# EAGLE design detector (EAGLE 7.0.0)
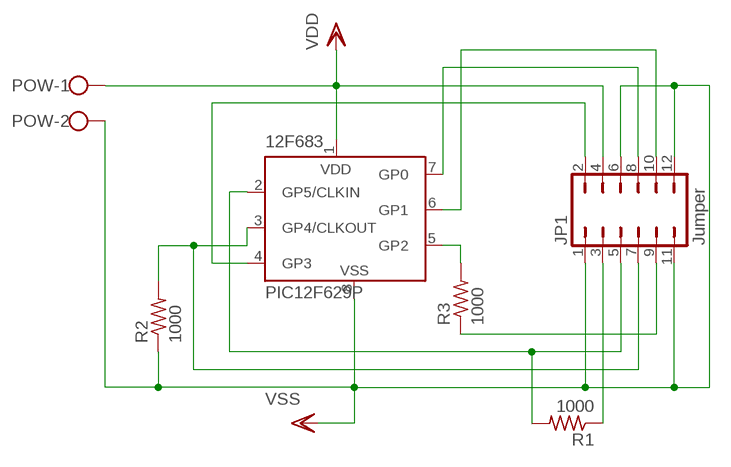
[diagram p0: schematic, sheet 1]

## Parts
12F683  PIC12F629P  [DIL8]
JP1  Jumper  JP6Q  [JP6Q]
POW  W237-102  [W237-102]
R1  1000  R-US_0207/10  [0207/10]
R2  1000  R-US_0207/10  [0207/10]
R3  1000  R-US_0207/10  [0207/10]

## Nets
N$1: 12F683.2(GP5/CLKIN) JP1.5 R1.2
N$3: JP1.9 R3.1
N$4: 12F683.3(GP4/CLKOUT) JP1.7 R2.2
N$5: JP1.3 R1.1
N$6: 12F683.4(GP3) JP1.2
N$7: 12F683.6(GP1) JP1.10
N$8: 12F683.7(GP0) JP1.8
N$9: 12F683.5(GP2) R3.2
VDD: 12F683.1(VDD) JP1.4 POW.1
VSS: 12F683.8(VSS) JP1.1 JP1.6 JP1.11 JP1.12 POW.2 R2.1

## Library data of the parts
12F683 = microchip:PIC12F6*: Data Sheet 8-Pin FLASH-Based 8-Bit CMOS Microcontrollers Source: http://www.microchip.com .. 41190c.pdf; MF: MICROCHIP; MPN: PIC12F629-I/P; OC_FARNELL: 1292253; OC_NEWARK: 67K0822
JP1 = jumper:JP6Q: JUMPER
POW = con-wago-500:W237-102: WAGO SCREW CLAMP; MPN: 237-102; OC_FARNELL: unknown; OC_NEWARK: 70K9898
R1-R3 = rcl:R-US_: RESISTOR, American symbol

## Board
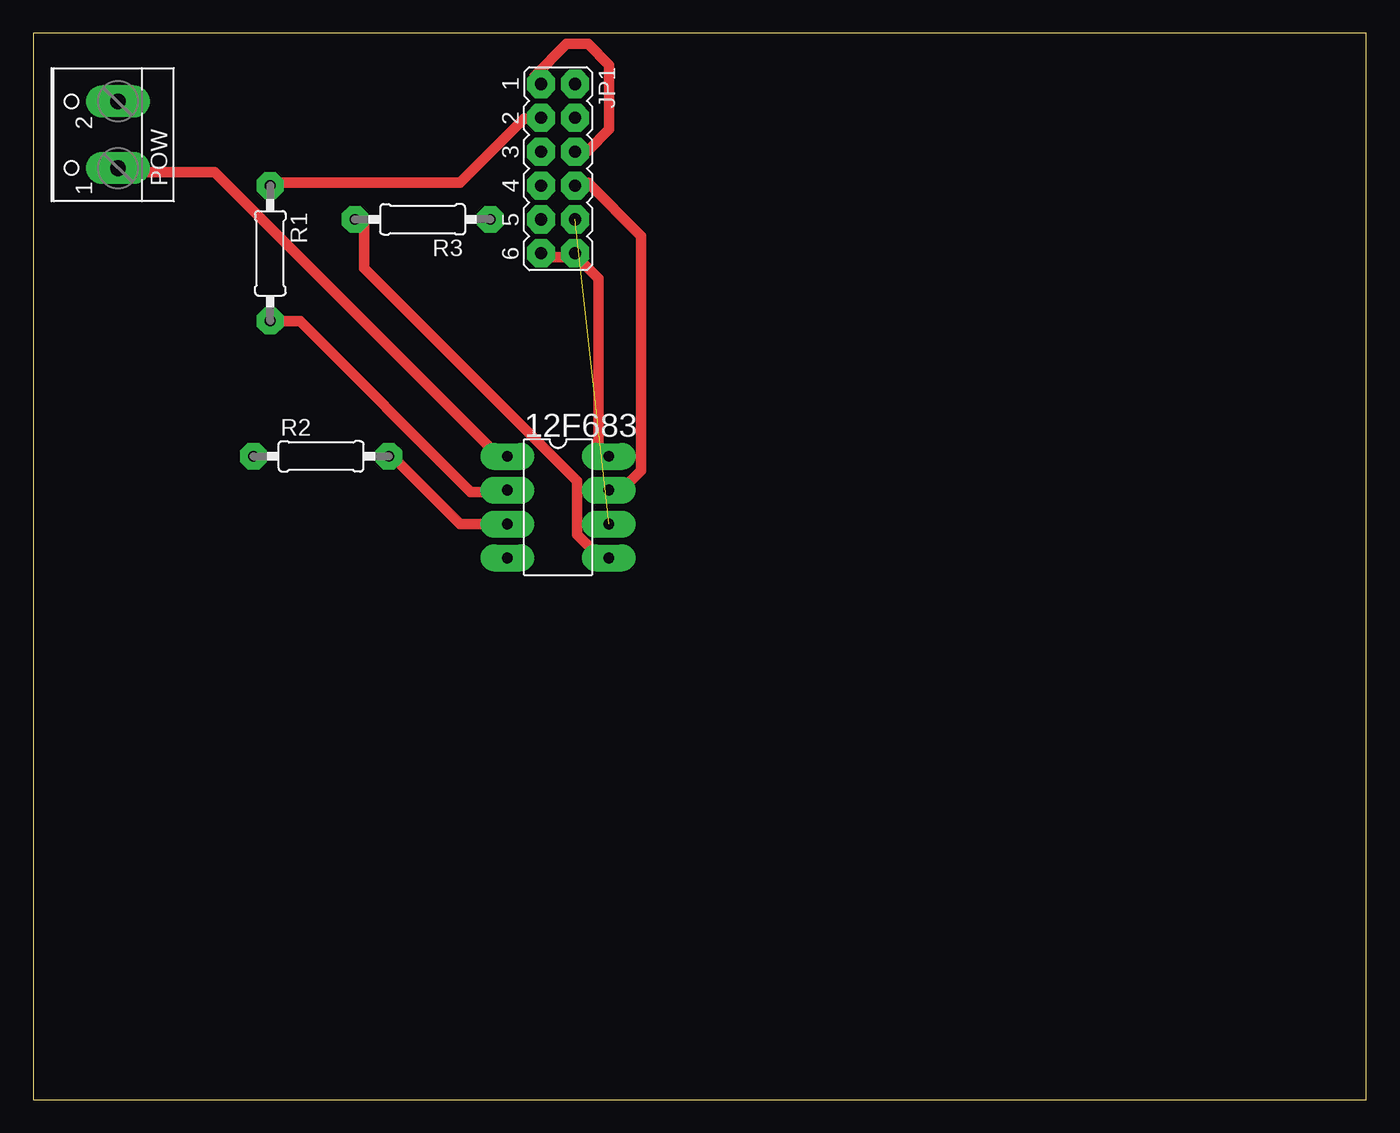
[diagram p1: board, top side]
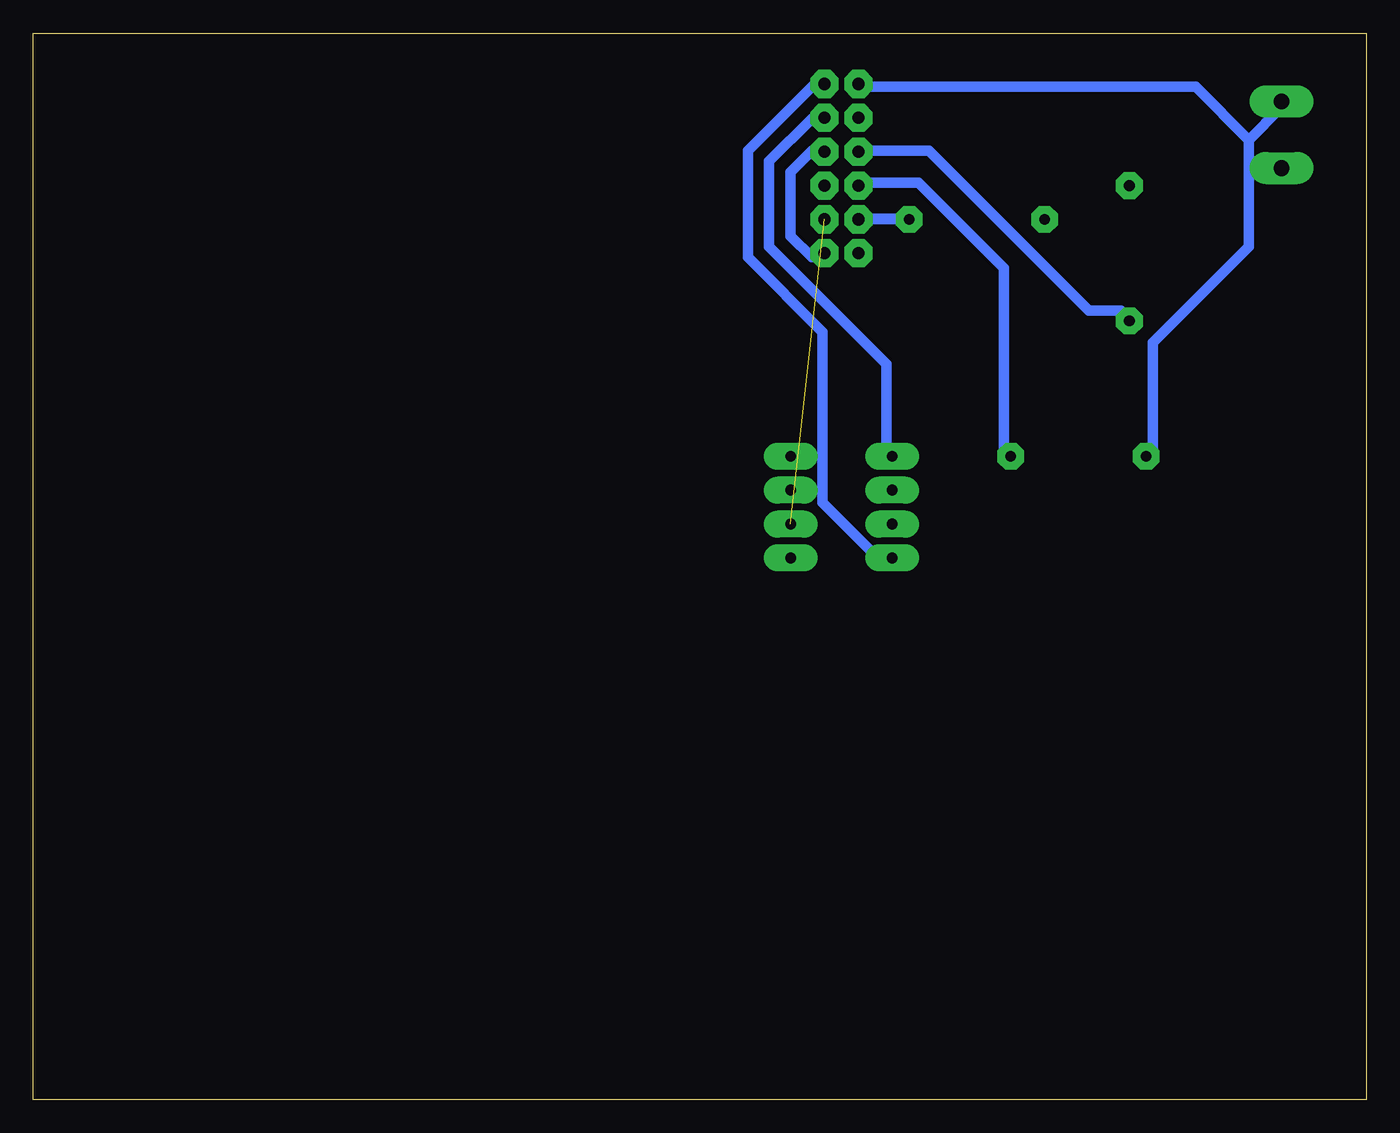
[diagram p2: board, bottom side, seen from below]

Size 100 x 80 mm. Coordinates in mm from the lower left corner, seen from the top.
Outline: 0,0 100,0 100,80 0,80 0,0
Copper layers (1*16): Top 0.035mm / dielectric 1.5mm / Bottom 0.035mm
Design rules "hobbyist": minimum track width 0.8mm, minimum drill 0.8mm, track to track 0.8mm, track to pad 0.8mm, pad to pad 0.45mm, via to via 0.8mm, smd to smd 8mil, copper to edge 10mil, drill to drill 8mil, minimum pad ring 0.6mm, minimum via ring 0.6mm, stop-mask expansion 0mil, vias tented up to drill 0mil, thermal gap 10mil

### Footprints (pad centres in the part's own frame; a part is rotated, then mirrored left to right if it is on the bottom)
DIL8 = drill 0.813 long: 1 -3.81,-3.81; 2 -1.27,-3.81; 3 1.27,-3.81; 4 3.81,-3.81; 5 3.81,3.81; 6 1.27,3.81; 7 -1.27,3.81; 8 -3.81,3.81
JP6Q = drill 0.914 octagon: 1 -6.35,-1.27; 2 -6.35,1.27; 3 -3.81,-1.27; 4 -3.81,1.27; 5 -1.27,-1.27; 6 -1.27,1.27; 7 1.27,-1.27; 8 1.27,1.27; 9 3.81,-1.27; 10 3.81,1.27; 11 6.35,-1.27; 12 6.35,1.27
W237-102 = drill 1.194 long: 1 -2.5,-1.27; 2 2.5,-1.27
0207/10 = drill 0.813 octagon: 1 -5.08,0; 2 5.08,0

### Placement (x,y rotation side)
12F683  39.37,44.45 270 top
JP1  39.37,69.85 270 top
POW  5.08,72.39 90 top
R1  17.78,63.5 270 top
R2  21.59,48.26 0 top
R3  29.21,66.04 180 top

### Tracks (layer width: path | path; a pad name or v marks a point on that pad's centre or on a via)
N$1
  Top 0.8: 12F683.2 35.2,45.6 32.8,45.6 20,58.4 18.4,58.4 R1.2
  Bottom 0.8: JP1.5 37.6,71.2 32.8,71.2 20.8,59.2 18.4,59.2 R1.2
N$3
  Bottom 0.813: R3.1 JP1.9
N$4
  Top 0.8: 12F683.3 35.2,43.2 32,43.2 27.2,48 R2.2
  Bottom 0.8: JP1.7 37.6,68.8 33.6,68.8 27.2,62.4 27.2,48.8 R2.2
N$5
  Top 0.8: R1.1 18.4,68.8 32,68.8 36.8,73.6 37.6,73.6 JP1.3
N$6
  Bottom 0.8: 12F683.4 36,40.8 36.8,40.8 40.8,44.8 40.8,57.6 46.4,63.2 46.4,71.2 40.8,76.8 JP1.2
N$7  (1 unrouted)
N$8
  Top 0.8: 12F683.7 43.2,45.6 44,45.6 45.6,47.2 45.6,64.8 41.6,68.8 40.8,68.8 JP1.8
N$9
  Top 0.8: R3.2 24.8,65.6 24.8,62.4 40.8,46.4 40.8,42.4 42.4,40.8 12F683.5
VDD
  Top 0.8: POW.1 6.4,69.6 13.6,69.6 35.2,48 12F683.1
  Bottom 0.8: 12F683.1 36,48.8 36,55.2 44.8,64 44.8,70.4 41.6,73.6 40.8,73.6 JP1.4
VSS
  Top 0.8: 12F683.8 42.4,48.8 42.4,61.6 40.8,63.2 JP1.12 40,63.2 38.4,63.2 JP1.11 | JP1.1 37.6,76.8 40,79.2 41.6,79.2 43.2,77.6 43.2,72.8 41.6,71.2 40.8,71.2 JP1.6
  Bottom 0.8: JP1.6 40.8,71.2 41.6,71.2 43.2,69.6 43.2,64.8 41.6,63.2 40.8,63.2 JP1.12 | 8.8,72 8.8,64 16,56.8 16,48.8 R2.1 | 8.8,72 6.4,74.4 POW.2 | 8.8,72 12.8,76 37.6,76 JP1.1